# Altium schematic sheet LCD&Camera&Connectors.SchDoc
size A4; Revision: B.2(PCB.SCH)
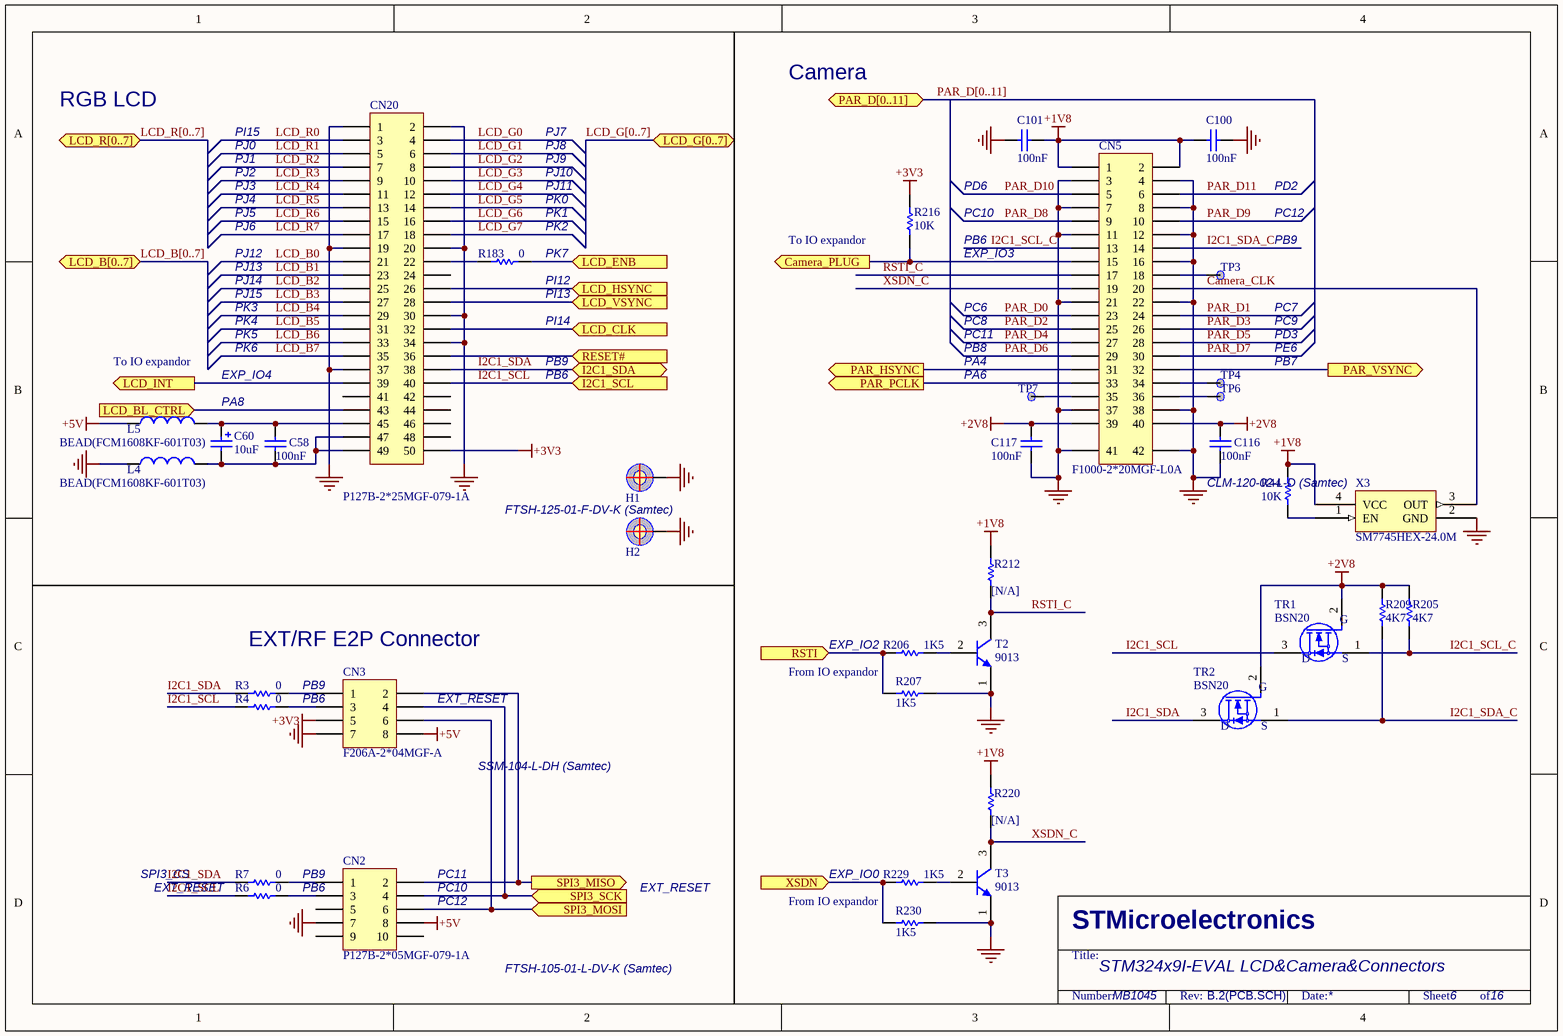
[diagram p0: LCD&Camera&Connectors.SchDoc]

## Parts
C58  100nF  [0603C]
C60  10uF  [TAN-A]
C100  100nF  [0603C]
C101  100nF  [0603C]
C116  100nF  [0603C]
C117  100nF  [0603C]
CN2  P127B-2*05MGF-079-1A  [FTSH-105-01-L-DV-K]
CN3  F206A-2*04MGF-A  [SSM-104-L-DH]
CN5  F1000-2*20MGF-L0A  [CLM-120-02-L-D]
CN20  P127B-2*25MGF-079-1A  [FTSH-125-01-F-DV]
H1  POSITION HOLE  [HOLE_C9D4R5]  (value not drawn)
H2  POSITION HOLE  [HOLE_C9D4R5]  (value not drawn)
L4  BEAD(FCM1608KF-601T03)  [0603L]
L5  BEAD(FCM1608KF-601T03)  [0603L]
R3  0  [0603R]
R4  0  [0603R]
R6  0  [0603R]
R7  0  [0603R]
R44  10K  [0402R]
R183  0  [0603R]
R205  4K7  [0603R]
R206  1K5  [0603R]
R207  1K5  [0603R]
R209  4K7  [0603R]
R212  [N/A]  [0603R]
R216  10K  [0603R]
R220  [N/A]  [0603R]
R229  1K5  [0603R]
R230  1K5  [0603R]
T2  9013  [SOT23-213]
T3  9013  [SOT23-213]
TP3  (no value)  [TP]
TP4  (no value)  [TP]
TP6  (no value)  [TP]
TP7  (no value)  [TP]
TR1  BSN20  [SOT23-213]
TR2  BSN20  [SOT23-213]
X3  SM7745HEX-24.0M  [OSC_4SM_7X5]

## Ports
Camera_PLUG (out), I2C1_SCL (in), I2C1_SDA (bidir), LCD_B[0..7] (bidir), LCD_BL_CTRL (in), LCD_CLK (in), LCD_ENB (in), LCD_G[0..7] (bidir), LCD_HSYNC (in), LCD_INT (out), LCD_R[0..7] (bidir), LCD_VSYNC (in), PAR_D[0..11] (bidir), PAR_HSYNC (out), PAR_PCLK (out), PAR_VSYNC (out), RESET# (in), RSTI (in), SPI3_MISO (out), SPI3_MOSI (in), SPI3_SCK (in), XSDN (in)

## Nets
+1V8: C100.1 C101.2 CN5.1 CN5.2 R44.2 R212.2 R220.2 X3.4(VCC)
+2V8: C116.1 C117.1 CN5.39 CN5.40 R205.2 R209.2 TR1.2(G) TR2.2(G)
+3V3: CN3.5 CN20.50 R216.1
+5V: CN2.8 CN3.8 L5.1
GND: C100.2 C101.1 C116.2 C117.2 CN2.7 CN3.7 CN5.3 CN5.4 CN5.7 CN5.8 CN5.11 CN5.12 CN5.16 CN5.21 CN5.22 CN5.37 CN5.38 CN5.41 CN5.42 CN20.1 CN20.2 CN20.19 CN20.20 CN20.30 CN20.34 CN20.37 H1.1 H2.1 L4.1 R207.2 R230.2 T2.1(E) T3.1(E) X3.2(GND)
Camera_CLK: CN5.20 X3.3(OUT)
Camera_PLUG: CN5.15 R216.2 ; port Camera_PLUG
I2C1_SCL: CN20.40 R4.1 R6.1 TR1.3(D) ; port I2C1_SCL
I2C1_SCL_C: CN5.13 R205.1 TR1.1(S)
I2C1_SDA: CN20.38 R3.1 R7.1 TR2.3(D) ; port I2C1_SDA
I2C1_SDA_C: CN5.14 R209.1 TR2.1(S)
LCD_B0: CN20.21
LCD_B1: CN20.23
LCD_B2: CN20.25
LCD_B3: CN20.27
LCD_B4: CN20.29
LCD_B5: CN20.31
LCD_B6: CN20.33
LCD_B7: CN20.35
LCD_BL_CTRL: CN20.43 ; port LCD_BL_CTRL
LCD_CLK: CN20.32 ; port LCD_CLK
LCD_ENB: R183.2 ; port LCD_ENB
LCD_G0: CN20.4
LCD_G1: CN20.6
LCD_G2: CN20.8
LCD_G3: CN20.10
LCD_G4: CN20.12
LCD_G5: CN20.14
LCD_G6: CN20.16
LCD_G7: CN20.18
LCD_HSYNC: CN20.26 ; port LCD_HSYNC
LCD_INT: CN20.39 ; port LCD_INT
LCD_R0: CN20.3
LCD_R1: CN20.5
LCD_R2: CN20.7
LCD_R3: CN20.9
LCD_R4: CN20.11
LCD_R5: CN20.13
LCD_R6: CN20.15
LCD_R7: CN20.17
LCD_VSYNC: CN20.28 ; port LCD_VSYNC
PAR_D0: CN5.23
PAR_D1: CN5.24
PAR_D2: CN5.25
PAR_D3: CN5.26
PAR_D4: CN5.27
PAR_D5: CN5.28
PAR_D6: CN5.29
PAR_D7: CN5.30
PAR_D8: CN5.9
PAR_D9: CN5.10
PAR_D10: CN5.5
PAR_D11: CN5.6
PAR_HSYNC: CN5.31 ; port PAR_HSYNC
PAR_PCLK: CN5.33 ; port PAR_PCLK
PAR_VSYNC: CN5.32 ; port PAR_VSYNC
RESET#: CN20.36 ; port RESET#
RSTI: R206.2 R207.1 ; port RSTI
RSTI_C: CN5.17 R212.1 T2.3(C)
SPI3_MISO: CN2.2 CN3.2 ; port SPI3_MISO
SPI3_MOSI: CN2.6 CN3.6 ; port SPI3_MOSI
SPI3_SCK: CN2.4 CN3.4 ; port SPI3_SCK
XSDN: R229.2 R230.1 ; port XSDN
XSDN_C: CN5.19 R220.1 T3.3(C)
NetC58_1: C58.1 C60.1 CN20.45 L5.2
NetC58_2: C58.2 C60.2 CN20.47 CN20.49 L4.2
NetCN2_1: CN2.1 R7.2
NetCN2_3: CN2.3 R6.2
NetCN3_1: CN3.1 R3.2
NetCN3_3: CN3.3 R4.2
NetCN5_18: CN5.18 TP3.1
NetCN5_34: CN5.34 TP4.1
NetCN5_35: CN5.35 TP7.1
NetCN5_36: CN5.36 TP6.1
NetCN20_22: CN20.22 R183.1
NetR44_1: R44.1 X3.1(EN)
NetR206_1: R206.1 T2.2(B)
NetR229_1: R229.1 T3.2(B)

Not connected (* = marked no-connect by the designer): CN2 5 9 10; CN20 24 41 42 44 46 48

## Buses and harness runs
bus LCD_B[0..7] = port LCD_B[0..7]
bus LCD_G[0..7] = port LCD_G[0..7]
bus LCD_R[0..7] = port LCD_R[0..7]
bus PAR_D[0..11] = port PAR_D[0..11]

## Notes on the sheet
- RGB LCD
- Camera
- PI15
- PJ0
- PJ1
- PJ2
- PJ7
- PJ8
- PJ9
- PJ10
- PJ3
- PJ4
- PJ5
- PJ6
- PJ11
- PK0
- (near R183) PK1
- (near R183) PK2
- (near R216) To IO expandor
- PC10
- PB6
- PD6
- PB9
- PD2
- PC12
- PJ12
- PJ13
- PJ14
- PJ15
- PK3
- (near R183) PK7
- (near R183) PI12
- (near R183) PI13
- PC6
- EXP_IO3
- PC7
- To IO expandor
- EXP_IO4
- PK4
- PK5
- PK6
- PI14
- PC11
- PB8
- PA4
- PA6
- PC8
- PE6
- PC9
- PB7
- PD3
- PA8
- FTSH-125-01-F-DV-K (Samtec)
- CLM-120-02-L-D (Samtec)
- EXT/RF E2P Connector
- (near R206) EXP_IO2
- (near CN3) EXT_RESET
- From IO expandor
- (near CN3) SSM-104-L-DH (Samtec)
- SPI3_CS
- EXT_RESET
- (near CN2) PC12
- (near CN2) PC11
- (near CN2) PC10
- (near R229) EXP_IO0
- (near CN2) FTSH-105-01-L-DV-K (Samtec)
- STM324x9I-EVAL LCD&Camera&Connectors
- MB1045
- 6
- 16
- STMicroelectronics
- Title:
- Number:
- Rev:
- Date:
- Sheet          of

## Library data of the parts
C58 C100 C101 C116 C117 = Cap: Capacitor; Value: 10nF; Published: 8-Jun-2000; Revision: July-2002: Re-released for DXP Platform.; Publisher: Altium Limited
C60 = Cap Pol1: Polarized Capacitor (Radial); Published: 8-Jun-2000; Revision: July-2002: Re-released for DXP Platform.; Publisher: Altium Limited; Value: 10uF
CN2 = FTSH-15-01-L-DV-ES-K: Header, 5-Pin, Dual row; Revision: 17-Jul-2002: Re-released for DXP Platform.; Publisher: Altium Limited
CN3 = SSM-104-L-DH: Header, 5-Pin, Dual row; Revision: 17-Jul-2002: Re-released for DXP Platform.; Publisher: Altium Limited
CN5 = CLM-120-02-L-D: Header, 20-Pin, Dual row; Revision: 17-Jul-2002: Re-released for DXP Platform.; Publisher: Altium Limited
CN20 = Header 25X2: Header, 26-Pin, Dual row; Revision: 17-Jul-2002: Re-released for DXP Platform.; Publisher: Altium Limited
L4 L5 = Inductor: Value: 100uH; Published: 8-Jun-2000; Revision: July-2002: Re-released for DXP Platform.; Publisher: Altium Limited
R3 R4 R6 R7 R44 R183 R206 R207 R216 R229 R230 = Res1: Resistor; Value: 1K; Published: 8-Jun-2000; Revision: July-2002: Re-released for DXP Platform.; Publisher: Altium Limited
R205 R209 R212 R220 = res1: Resistor; Value: 1K; Published: 8-Jun-2000; Revision: July-2002: Re-released for DXP Platform.; Publisher: Altium Limited
T2 T3 = NPN: NPN Bipolar Transistor; Code - JEDEC: TO-226-AA; Published: 8-Jun-2000; Revision: July-2002: Re-released for DXP Platform.; Publisher: Altium Limited
TP3 TP4 TP6 TP7 = TP
TR1 TR2 = 2N7000
X3 = SM7745HEV-50.0M